# Altium schematic sheet USB.SchDoc
size A
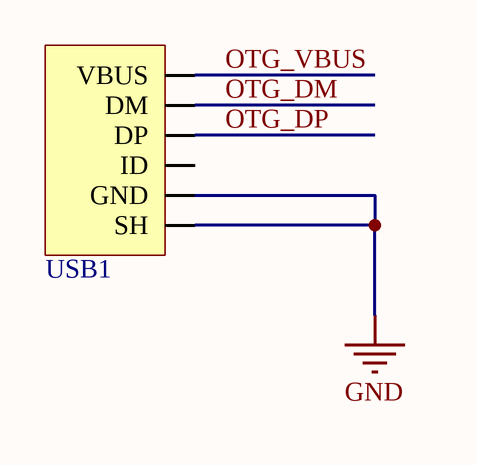
[diagram p0: USB.SchDoc]

## Parts
USB1  USB_Micro  [USB_Micro-AB]  (value not drawn)

## Nets
GND: USB1.0(SH) USB1.5(GND)
OTG_DM: USB1.2(DM)
OTG_DP: USB1.3(DP)
OTG_VBUS: USB1.1(VBUS)

Not connected (* = marked no-connect by the designer): USB1 4(ID)

## Library data of the parts
USB1 = USB_Micro: USB